# EAGLE schematic motor_driver_eagle (EAGLE 7.5.0)

## Sheet 1 of 3: Sheet1
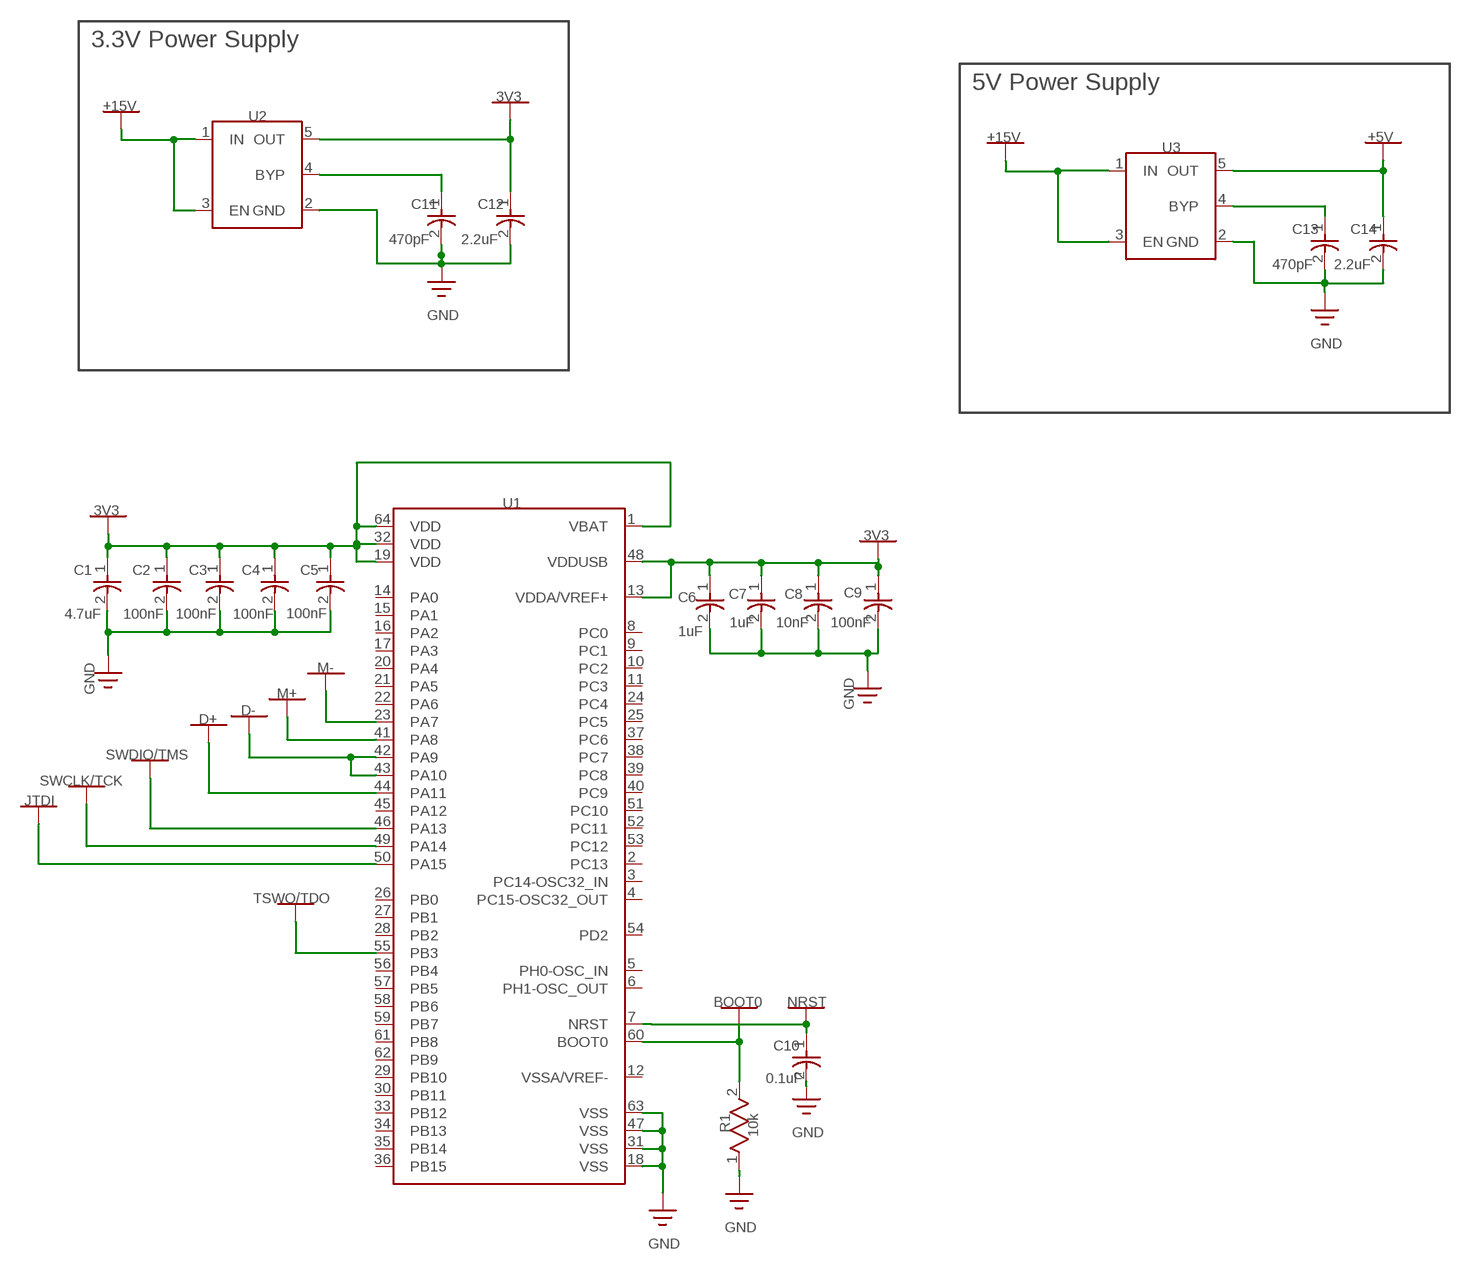
[diagram p0: schematic, sheet 1]

### Parts
C1  4.7uF  CAP_0805  [CAP_0805]
C2  100nF  CAP_0805  [CAP_0805]
C3  100nF  CAP_0805  [CAP_0805]
C4  100nF  CAP_0805  [CAP_0805]
C5  100nF  CAP_0805  [CAP_0805]
C6  1uF  CAP_0805  [CAP_0805]
C7  1uF  CAP_0805  [CAP_0805]
C8  10nF  CAP_0805  [CAP_0805]
C9  100nF  CAP_0805  [CAP_0805]
C10  0.1uF  CAP_0805  [CAP_0805]
C11  470pF  CAP_0805  [CAP_0805]
C12  2.2uF  CAP_0805  [CAP_0805]
C13  470pF  CAP_0805  [CAP_0805]
C14  2.2uF  CAP_0805  [CAP_0805]
R1  10k  RES_0603  [RES_0603]
U1  STM32L476RGT6TR  [QFP64P50_1200X1200X160L60X22N_AD11]
U2  MIC5219-3.3YM5-TR  [SOT23-5P95_280X145L45X37N]
U3  MIC5219-5.0YM5-TR  [SOT23-5P95_280X145L45X37N]

### Nets
3V3: C1.1 C2.1 C3.1 C4.1 C5.1 C6.1 C7.1 C8.1 C9.1 C12.1 U1.1(VBAT) U1.13(VDDA/VREF+) U1.19(VDD) U1.32(VDD) U1.48(VDDUSB) U1.64(VDD) U2.5(OUT) ; also sheet 2
+5V: C14.1 U3.5(OUT) ; also sheet 2
+15V: U2.1(IN) U2.3(EN) U3.1(IN) U3.3(EN) ; also sheet 3
BOOT0: R1.2 U1.60(BOOT0)
D+: U1.44(PA11) ; also sheet 2
D-: U1.42(PA9) U1.43(PA10) ; also sheet 2
GND: C1.2 C2.2 C3.2 C4.2 C5.2 C6.2 C7.2 C8.2 C9.2 C10.2 C11.2 C12.2 C13.2 C14.2 R1.1 U1.18(VSS) U1.31(VSS) U1.47(VSS) U1.63(VSS) U2.2(GND) U3.2(GND) ; also sheet 2,3
JTDI: U1.50(PA15) ; also sheet 2
Net_12: C11.1 U2.4(BYP)
Net_14: C13.1 U3.4(BYP)
Net_31: U1.41(PA8) ; supply symbol labelled M+ ; also sheet 3
Net_32: U1.23(PA7) ; supply symbol labelled M- ; also sheet 3
NRST: C10.1 U1.7(NRST) ; also sheet 2
SWCLK/TCK: U1.49(PA14) ; also sheet 2
SWDIO/TMS: U1.46(PA13) ; also sheet 2
TSWO/TDO: U1.55(PB3) ; also sheet 2
Unconnected: U1.2(PC13) U1.3(PC14-OSC32_IN) U1.4(PC15-OSC32_OUT) U1.5(PH0-OSC_IN) U1.6(PH1-OSC_OUT) U1.8(PC0) U1.9(PC1) U1.10(PC2) U1.11(PC3) U1.14(PA0) U1.15(PA1) U1.16(PA2) U1.17(PA3) U1.20(PA4) U1.21(PA5) U1.22(PA6) U1.24(PC4) U1.25(PC5) U1.26(PB0) U1.27(PB1) U1.28(PB2) U1.29(PB10) U1.30(PB11) U1.33(PB12) U1.34(PB13) U1.35(PB14) U1.36(PB15) U1.37(PC6) U1.38(PC7) U1.39(PC8) U1.40(PC9) U1.45(PA12) U1.51(PC10) U1.52(PC11) U1.53(PC12) U1.54(PD2) U1.56(PB4) U1.57(PB5) U1.58(PB6) U1.59(PB7) U1.61(PB8) U1.62(PB9)

### Notes on the sheet
- 3.3V Power Supply
- 5V Power Supply
- 3V3
- +15V
- U2
- +15V | +5V
- U3
- C11 | C12
- 470pF | 2.2uF | C13 | C14
- 470pF | 2.2uF
- GND
- GND
- U1
- 3V3
- 3V3
- C1 | C2 | C3 | C4 | C5
- C7 | C8 | C9
- C6
- 4.7uF | 100nF | 100nF | 100nF | 100nF
- 1uF | 10nF | 100nF
- 1uF
- M-
- GND
- M+
- GND
- D-
- D+
- SWDIO/TMS
- SWCLK/TCK
- JTDI
- TSWO/TDO
- BOOT0 | NRST
- C10
- 0.1uF
- R1
- 10k | GND
- GND
- GND

## Sheet 2 of 3: Sheet3
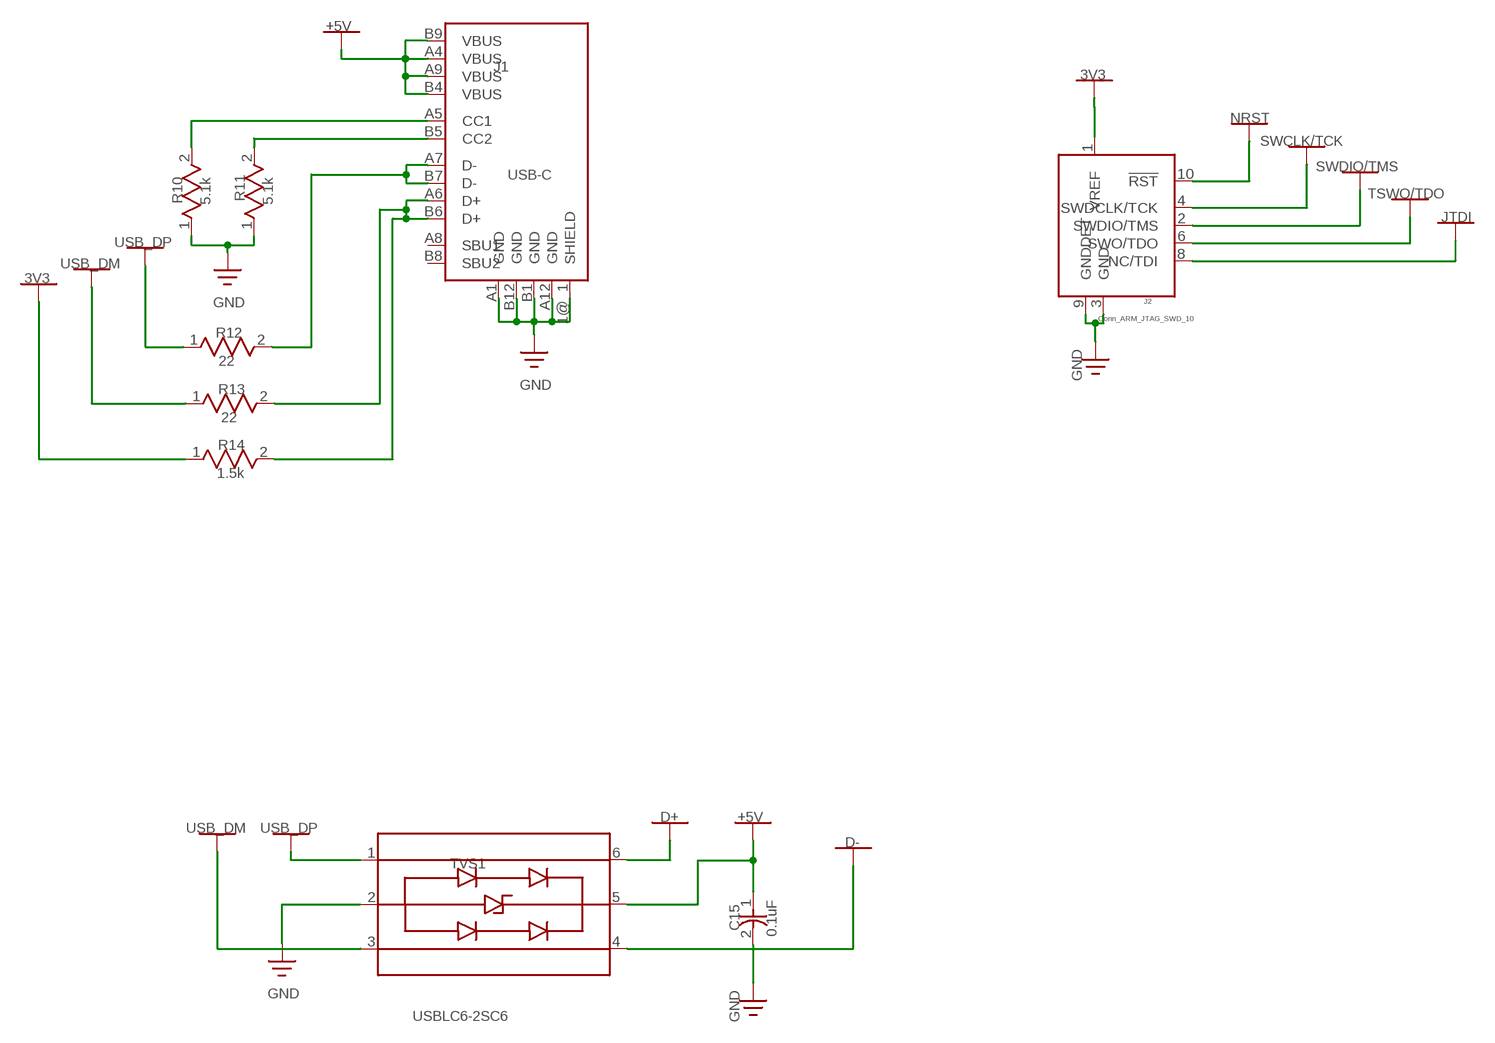
[diagram p1: schematic, sheet 2]

### Parts
C15  0.1uF  CAP_0805  [CAP_0805]
J1  USB4105-GF-A  USB_C_RECEPTACLE_USB2.0_16P  [USBC_PORT]
J2  CONN_ARM_JTAG_SWD_10  [CONN_ARM_JTAG_SWD_10]
R10  5.1k  RES_0603  [RES_0603]
R11  5.1k  RES_0603  [RES_0603]
R12  22  RES_0603  [RES_0603]
R13  22  RES_0603  [RES_0603]
R14  1.5k  RES_0603  [RES_0603]
TVS1  USBLC6-2SC6  [SOT23-6]

### Nets
3V3: J2.1(VREF) R14.1 ; also sheet 1
+5V: C15.1 J1.A4(VBUS) J1.A9(VBUS) J1.B4(VBUS) J1.B9(VBUS) TVS1.5 ; also sheet 1
D+: TVS1.6 ; also sheet 1
D-: TVS1.4 ; also sheet 1
GND: C15.2 J1.1@_1(SHIELD) J1.A1(GND) J1.A12(GND) J1.B1(GND) J1.B12(GND) J2.3(GND) J2.9(GNDDET) R10.1 R11.1 TVS1.2 ; also sheet 1,3
JTDI: J2.8(NC/TDI) ; also sheet 1
Net_0: J1.A5(CC1) R10.2
Net_3: J1.B5(CC2) R11.2
Net_26: J1.A7(D-) J1.B7(D-) R12.2
Net_27: J1.A6(D+) J1.B6(D+) R13.2 R14.2
Net_28: R12.1 TVS1.1 ; supply symbol labelled USB_DP
Net_29: R13.1 TVS1.3 ; supply symbol labelled USB_DM
NRST: J2.10(!RST) ; also sheet 1
SWCLK/TCK: J2.4(SWDCLK/TCK) ; also sheet 1
SWDIO/TMS: J2.2(SWDIO/TMS) ; also sheet 1
TSWO/TDO: J2.6(SWO/TDO) ; also sheet 1
Unconnected: J1.A8(SBU1) J1.B8(SBU2)

### Notes on the sheet
- +5V
- J1
- 3V3
- NRST
- SWCLK/TCK
- USB-C | SWDIO/TMS
- R11 | TSWO/TDO
- R10 | 5.1k | 5.1k
- JTDI
- USB_DP
- USB_DM
- 3V3
- J2
- GND
- Conn_ARM_JTAG_SWD_10
- R12
- 22
- GND
- GND
- R13
- 22
- R14
- 1.5k
- D+ | +5V
- USB_DM | USB_DP
- D-
- TVS1
- C15
- 0.1uF
- GND
- USBLC6-2SC6
- GND

## Sheet 3 of 3: Sheet2
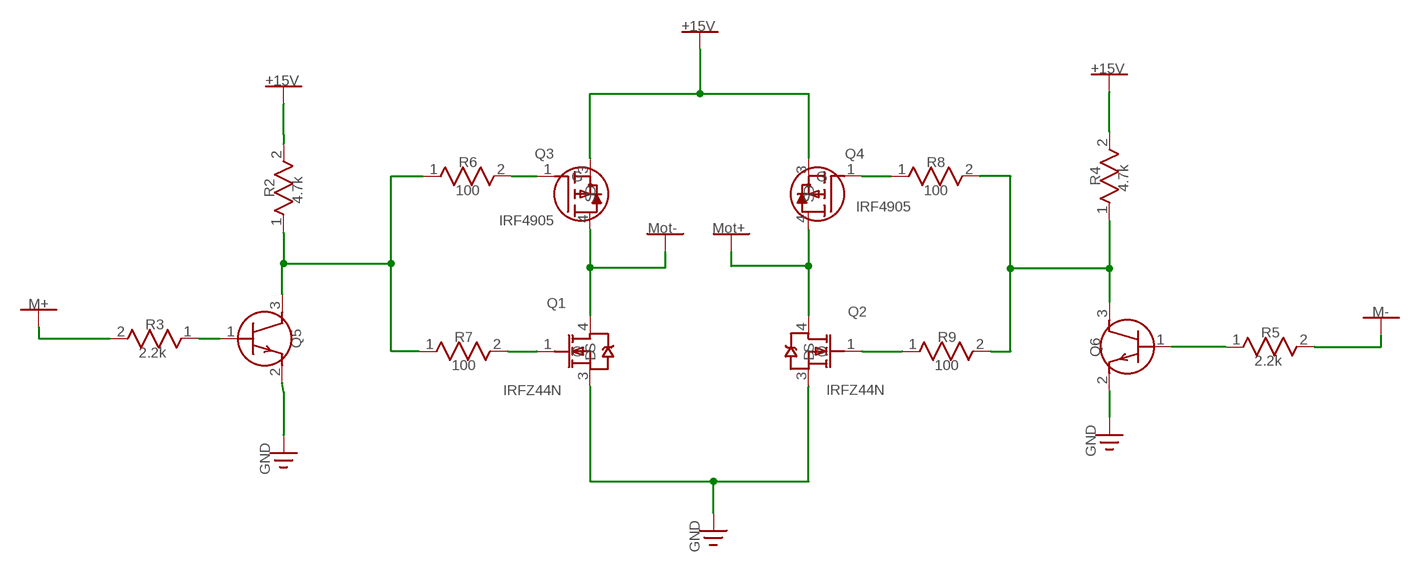
[diagram p2: schematic, sheet 3]

### Parts
Q1  IRFZ44N  [DPAK3P254_1524X483L228X75T686X1067N_AP2]
Q2  IRFZ44N_2  [DPAK3P254_1524X483L228X75T686X1067N_AP2]
Q3  IRF4905  [DPAK3P254_1524X483L228X75T686X1067N_AP2]
Q4  IRF4905_9  [DPAK3P254_1524X483L228X75T686X1067N_AP2]
Q5  SS8050-G  NPN  [SOT23]
Q6  NPN_31  [SOT23]
R2  4.7k  RES_0603  [RES_0603]
R3  2.2k  RES_0603  [RES_0603]
R4  4.7k  RES_0603  [RES_0603]
R5  2.2k  RES_0603  [RES_0603]
R6  100  RES_0603  [RES_0603]
R7  100  RES_0603  [RES_0603]
R8  100  RES_0603  [RES_0603]
R9  100  RES_0603  [RES_0603]

### Nets
+15V: Q3.3(S) Q4.3(S) R2.2 R4.2 ; also sheet 1
GND: Q1.3(S) Q2.3(S) Q5.2(E) Q6.2(E) ; also sheet 1,2
Net_1: Q6.3(C) R4.1 R8.2 R9.2
Net_2: Q6.1(B) R5.1
Net_16: Q1.4(D) Q3.4(D) ; supply symbol labelled MOT-
Net_17: Q2.4(D) Q4.4(D) ; supply symbol labelled MOT+
Net_18: Q5.3(C) R2.1 R6.1 R7.1
Net_19: Q5.1(B) R3.1
Net_20: Q1.1(G) R7.2
Net_23: Q3.1(G) R6.2
Net_24: Q2.1(G) R9.1
Net_25: Q4.1(G) R8.1
Net_31: R3.2 ; supply symbol labelled M+ ; also sheet 1
Net_32: R5.2 ; supply symbol labelled M- ; also sheet 1

### Notes on the sheet
- +15V
- +15V
- +15V
- Q3 | Q4
- R6 | R8
- 100 | 100 | R4
- 4.7k
- R2
- 4.7k | IRF4905
- IRF4905
- Mot- | Mot+
- M+ | Q1
- Q2 | M-
- R3
- Q6 | R5
- R7 | R9
- 2.2k | Q5
- 2.2k
- 100 | 100
- IRFZ44N
- IRFZ44N
- GND
- GND
- GND

## Power pins joined to a net without a drawn wire
VSSA/VREF-: U1.12(VSSA/VREF-)

## Library data of the parts
C1 = common:CAP_0805; UNIQUE_NAME: CAP_0805
C2-C15 = common:CAP_0805; UNIQUE_NAME: CAP_0805; VALUE: 4.7uF
J1 = common:USB_C_RECEPTACLE_USB2.0_16P
J2 = common:CONN_ARM_JTAG_SWD_10
Q1 = common:IRFZ44N; MANUFACTURER: International Rectifier; PART_NUMBER_(DIGI-KEY): IRFZ44NPBF-ND; PART_NUMBER_(LCSC): C725092; PART_NUMBER_(MOUSER): 942-IRFZ44NPBF; UNIQUE_NAME: IR_TO-220AB
Q2 = common:IRFZ44N_2; MANUFACTURER: International Rectifier; PART_NUMBER_(DIGI-KEY): IRFZ44; PART_NUMBER_(LCSC): C725092; PART_NUMBER_(MOUSER): 942-IRFZ44NPBF; UNIQUE_NAME: IR_TO-220AB
Q3 = common:IRF4905; DATASHEET: http://datasheets.diptrace.com/infineon/IRF4905STRLPBF_and_series.pdf; MANUFACTURER: Infineon Technologies; PART_NUMBER_(LCSC): C2620; UNIQUE_NAME: IR_D2PAK
Q4 = common:IRF4905_9; DATASHEET: http://datasheets.diptrace.com/infineon/IRF4905STRLPBF_and_series.pdf; MANUFACTURER: Infineon Technologies; PART_NUMBER_(LCSC): C2620; UNIQUE_NAME: IR_D2PAK
Q5 = common:NPN; DESCRIPTION: NPN Transistor
Q6 = common:NPN_31; DESCRIPTION: NPN Transistor
R1 = common:RES_0603; UNIQUE_NAME: RES_0603
R2-R14 = common:RES_0603; UNIQUE_NAME: RES_0603; VALUE: 10k
TVS1 = common:USBLC6-2SC6
U1 = common:STM32L476RGT6TR; DATASHEET: http://datasheets.diptrace.com/st_micro/STM32L476.pdf; MANUFACTURER: ST Microelectronics; PART_NUMBER_(DIGI-KEY): STM32L476RGT6TR-ND; PART_NUMBER_(LCSC): C2054081; PART_NUMBER_(MOUSER): 511-STM32L476RGT6TR; UNIQUE_NAME: ST_LQFP64_10X10
U2 = common:MIC5219-3.3YM5-TR; DATASHEET: http://datasheets.diptrace.com/microchip/mic5219.pdf; MANUFACTURER: Microchip; PART_NUMBER_(DIGI-KEY): 576-1281-6-ND; PART_NUMBER_(LCSC): C481375; PART_NUMBER_(MOUSER): 998-MIC5219-3.3YM5TR; UNIQUE_NAME: MICROCHIP_SOT-23-5L_M5
U3 = common:MIC5219-5.0YM5-TR; DATASHEET: http://datasheets.diptrace.com/microchip/mic5219.pdf; MANUFACTURER: Microchip; PART_NUMBER_(DIGI-KEY): 576-2770-6-ND; PART_NUMBER_(LCSC): C144182; PART_NUMBER_(MOUSER): 998-MIC5219-5.0YM5TR; UNIQUE_NAME: MICROCHIP_SOT-23-5L_M5